# Altium schematic sheet 原理图.schdoc
size 135 x 98 mm
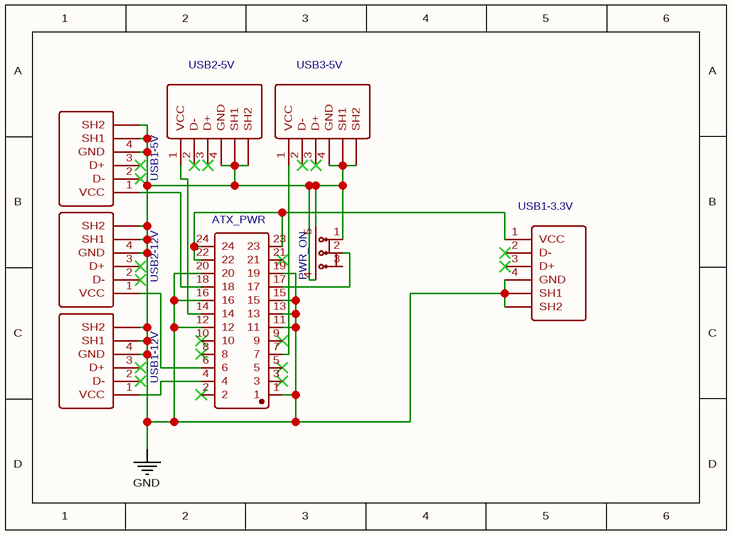
[diagram p0: 原理图.schdoc]

## Parts
ATX_PWR  5557S-2*12P  [CONN-TH_12P-P4.20_5557S-2-12P]  (value not drawn)
PWR_ON  SS-12D02-VG4_C2998801  [SW-TH_DEALON_SS-12D02-VGX]  (value not drawn)
USB1-3.3V  U-USBAM04P-F001  [USB-A-SMD_U-USBAM04P-F000]  (value not drawn)
USB1-5V  U-USBAM04P-F001  [USB-A-SMD_U-USBAM04P-F000]  (value not drawn)
USB1-12V  U-USBAM04P-F001  [USB-A-SMD_U-USBAM04P-F000]  (value not drawn)
USB2-5V  U-USBAM04P-F001  [USB-A-SMD_U-USBAM04P-F000]  (value not drawn)
USB2-12V  U-USBAM04P-F001  [USB-A-SMD_U-USBAM04P-F000]  (value not drawn)
USB3-5V  U-USBAM04P-F001  [USB-A-SMD_U-USBAM04P-F000]  (value not drawn)

## Nets
GND: ATX_PWR.1 ATX_PWR.11 ATX_PWR.12 ATX_PWR.13 ATX_PWR.15 ATX_PWR.16 ATX_PWR.19 ATX_PWR.20 PWR_ON.1 PWR_ON.4 PWR_ON.5 USB1-3.3V.4(GND) USB1-3.3V.SH1 USB1-3.3V.SH2 USB1-5V.4(GND) USB1-5V.SH1 USB1-5V.SH2 USB1-12V.4(GND) USB1-12V.SH1 USB1-12V.SH2 USB2-5V.4(GND) USB2-5V.SH1 USB2-5V.SH2 USB2-12V.4(GND) USB2-12V.SH1 USB2-12V.SH2 USB3-5V.4(GND) USB3-5V.SH1 USB3-5V.SH2
NetATX_PWR_4: ATX_PWR.4 USB1-12V.1(VCC)
NetATX_PWR_6: ATX_PWR.6 USB2-12V.1(VCC)
NetATX_PWR_7: ATX_PWR.7 USB3-5V.1(VCC)
NetATX_PWR_14: ATX_PWR.14 USB2-5V.1(VCC)
NetATX_PWR_17: ATX_PWR.17 PWR_ON.2
NetATX_PWR_18: ATX_PWR.18 USB1-5V.1(VCC)
NetATX_PWR_22: ATX_PWR.22 ATX_PWR.23 ATX_PWR.24 USB1-3.3V.1(VCC)

Not connected (* = marked no-connect by the designer): ATX_PWR 2* 3* 5* 8* 9* 10* 21*; PWR_ON 3; USB1-3.3V 2(D-)* 3(D+)*; USB1-5V 2(D-)* 3(D+)*; USB1-12V 2(D-)* 3(D+)*; USB2-5V 2(D-)* 3(D+)*; USB2-12V 2(D-)* 3(D+)*; USB3-5V 2(D-)* 3(D+)*

## Library data of the parts
ATX_PWR = 5557S-2*12P: BOM_Manufacturer: Ckmtw(灿科盟); BOM_Manufacturer Part: W-5557S24P-0000; Contributor: LCSC; BOM_Supplier: LCSC; BOM_Supplier Part: C169053; BOM_JLCPCB Part Class: Extended Part; spicePre: C; spiceSymbolName: 5557S-2*12P
PWR_ON = SS-12D02-VG4_C2998801: BOM_Manufacturer: DEALON(德艺隆); Contributor: lcsc; BOM_Supplier: LCSC; BOM_Supplier Part: C2998801; BOM_Manufacturer Part: SS-12D02-VG4; link: https://atta.szlcsc.com/upload/public/pdf/source/20220425/3145953AA816D3345B9B6BC6DFA6A3BA.pdf; spicePre: U; spiceSymbolName: SS-12D02-VG4_C2998801
USB1-3.3V USB1-5V USB1-12V USB2-5V USB2-12V USB3-5V = U-USBAM04P-F001: BOM_Manufacturer: Ckmtw(灿科盟); Contributor: LCSC; BOM_Supplier: LCSC; BOM_Supplier Part: C2895042; BOM_Manufacturer Part: U-USBAM04P-F001; BOM_JLCPCB Part Class: Extended Part; spicePre: U; spiceSymbolName: U-USBAM04P-F001